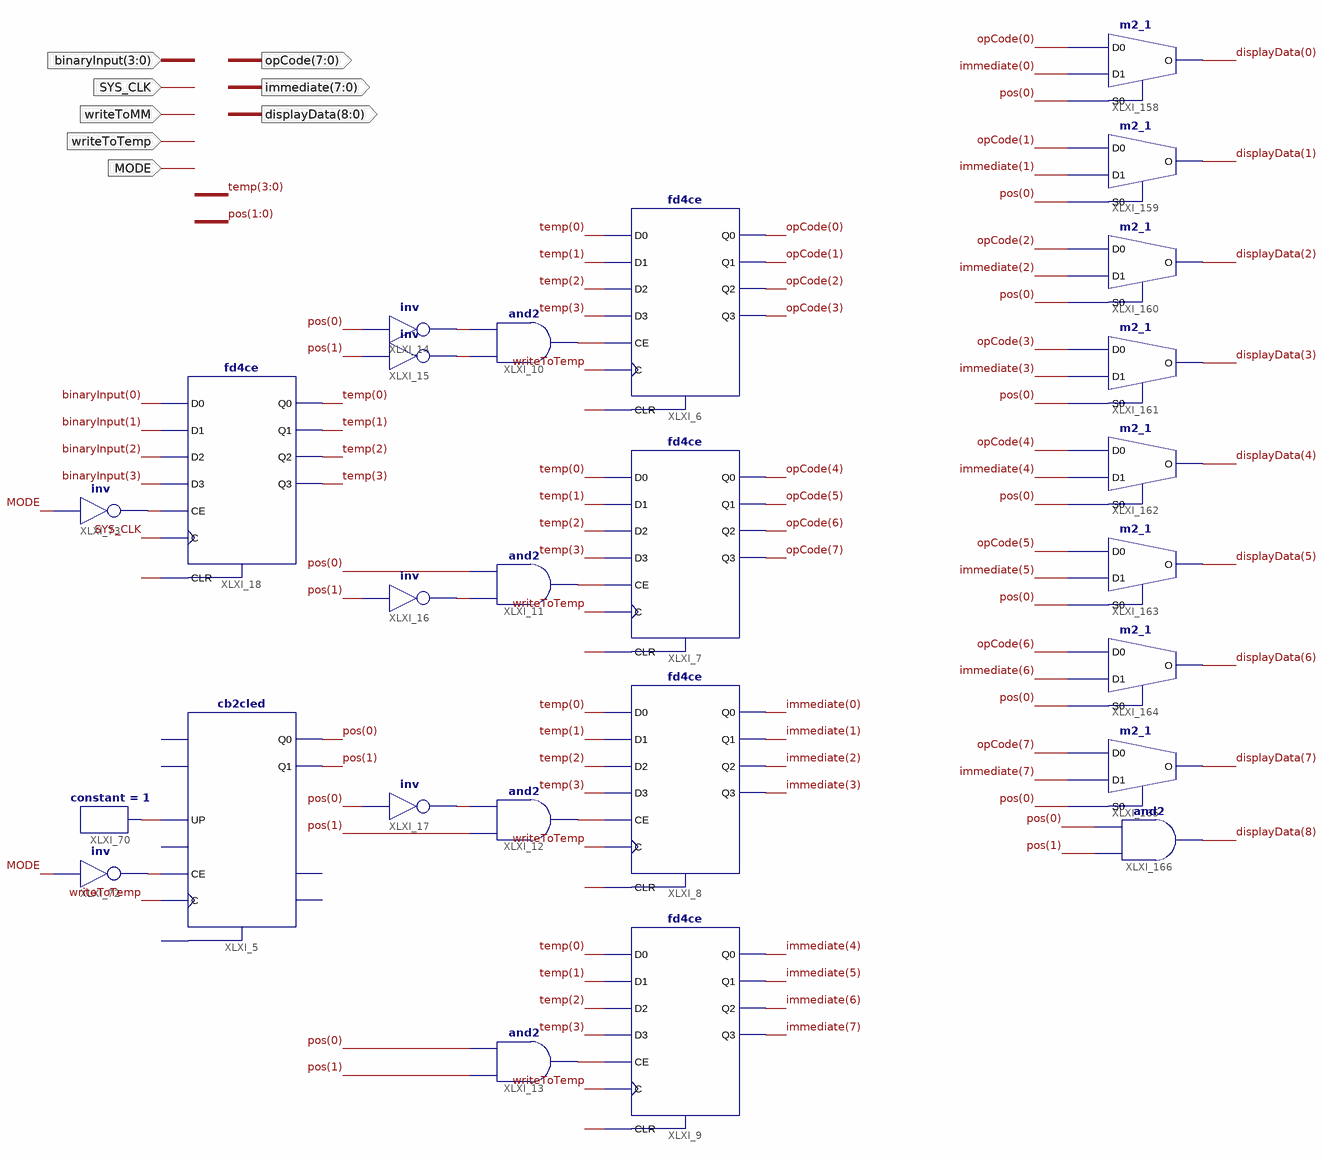
[diagram p0: schematic sheet 1]
// Xilinx ISE schematic inputProcessor.sch (spartan3e) as structural Verilog: 26 symbols, 8 ports
module inputProcessor (
  input  SYS_CLK,
  input  writeToTemp,
  input  [3:0] binaryInput,
  input  writeToMM,
  input  MODE,
  output [7:0] opCode,
  output [7:0] immediate,
  output [8:0] displayData
);

  wire XLXN_3, XLXN_4, XLXN_5, XLXN_6, XLXN_7, XLXN_8, XLXN_9, XLXN_10, XLXN_77, XLXN_78, XLXN_79, XLXN_80,
       XLXN_87, XLXN_365, XLXN_368, XLXN_369;
  wire [1:0] pos;
  wire [3:0] temp;

  fd4ce XLXI_18 (
    .C(SYS_CLK), .CE(XLXN_369), .CLR(XLXN_87), .D0(binaryInput[0]), .D1(binaryInput[1]), .D2(binaryInput[2]),
    .D3(binaryInput[3]), .Q0(temp[0]), .Q1(temp[1]), .Q2(temp[2]), .Q3(temp[3]));
  not XLXI_73 (XLXN_369, MODE);
  fd4ce XLXI_6 (
    .C(writeToTemp), .CE(XLXN_3), .CLR(XLXN_80), .D0(temp[0]), .D1(temp[1]), .D2(temp[2]), .D3(temp[3]),
    .Q0(opCode[0]), .Q1(opCode[1]), .Q2(opCode[2]), .Q3(opCode[3]));
  fd4ce XLXI_7 (
    .C(writeToTemp), .CE(XLXN_4), .CLR(XLXN_79), .D0(temp[0]), .D1(temp[1]), .D2(temp[2]), .D3(temp[3]),
    .Q0(opCode[4]), .Q1(opCode[5]), .Q2(opCode[6]), .Q3(opCode[7]));
  fd4ce XLXI_8 (
    .C(writeToTemp), .CE(XLXN_5), .CLR(XLXN_77), .D0(temp[0]), .D1(temp[1]), .D2(temp[2]), .D3(temp[3]),
    .Q0(immediate[0]), .Q1(immediate[1]), .Q2(immediate[2]), .Q3(immediate[3]));
  fd4ce XLXI_9 (
    .C(writeToTemp), .CE(XLXN_6), .CLR(XLXN_78), .D0(temp[0]), .D1(temp[1]), .D2(temp[2]), .D3(temp[3]),
    .Q0(immediate[4]), .Q1(immediate[5]), .Q2(immediate[6]), .Q3(immediate[7]));
  not XLXI_15 (XLXN_7, pos[1]);
  not XLXI_14 (XLXN_10, pos[0]);
  and XLXI_10 (XLXN_3, XLXN_7, XLXN_10);
  not XLXI_16 (XLXN_8, pos[1]);
  and XLXI_11 (XLXN_4, XLXN_8, pos[0]);
  not XLXI_17 (XLXN_9, pos[0]);
  and XLXI_12 (XLXN_5, pos[1], XLXN_9);
  and XLXI_13 (XLXN_6, pos[1], pos[0]);
  cb2cled XLXI_5 (
    .C(writeToTemp), .CE(XLXN_368), .UP(XLXN_365), .Q0(pos[0]), .Q1(pos[1]));  // open: CLR, D0, D1, L, CEO, TC
  constant #(.CValue("1")) XLXI_70 (.O(XLXN_365));
  not XLXI_72 (XLXN_368, MODE);
  m2_1 XLXI_158 (.D0(opCode[0]), .D1(immediate[0]), .S0(pos[0]), .O(displayData[0]));
  m2_1 XLXI_159 (.D0(opCode[1]), .D1(immediate[1]), .S0(pos[0]), .O(displayData[1]));
  m2_1 XLXI_160 (.D0(opCode[2]), .D1(immediate[2]), .S0(pos[0]), .O(displayData[2]));
  m2_1 XLXI_161 (.D0(opCode[3]), .D1(immediate[3]), .S0(pos[0]), .O(displayData[3]));
  m2_1 XLXI_162 (.D0(opCode[4]), .D1(immediate[4]), .S0(pos[0]), .O(displayData[4]));
  m2_1 XLXI_163 (.D0(opCode[5]), .D1(immediate[5]), .S0(pos[0]), .O(displayData[5]));
  m2_1 XLXI_164 (.D0(opCode[6]), .D1(immediate[6]), .S0(pos[0]), .O(displayData[6]));
  m2_1 XLXI_165 (.D0(opCode[7]), .D1(immediate[7]), .S0(pos[0]), .O(displayData[7]));
  and XLXI_166 (displayData[8], pos[1], pos[0]);
endmodule
